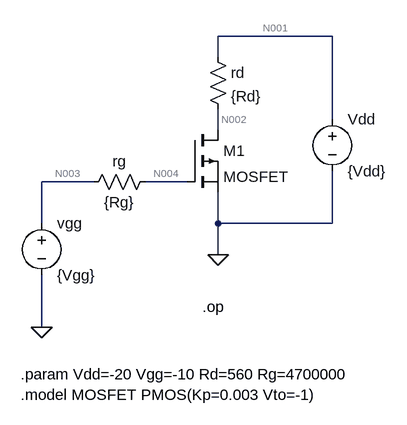
[diagram p0: schematic Q7-4.asc]
Q7-4.asc, the LTspice schematic file:
Version 4
SHEET 1 880 680
WIRE 544 -144 368 -144
WIRE 368 -112 368 -144
WIRE 544 -16 544 -144
WIRE 368 0 368 -32
WIRE 176 80 96 80
WIRE 320 80 256 80
WIRE 96 144 96 80
WIRE 368 144 368 96
WIRE 544 144 544 64
WIRE 544 144 368 144
WIRE 368 192 368 144
WIRE 96 304 96 224
FLAG 368 192 0
FLAG 96 304 0
SYMBOL voltage 96 128 R0
SYMATTR InstName vgg
SYMATTR Value {Vgg}
SYMBOL voltage 544 -32 R0
SYMATTR InstName Vdd
SYMATTR Value {Vdd}
SYMBOL res 352 -128 R0
SYMATTR InstName rd
SYMATTR Value {Rd}
SYMBOL res 272 64 R90
WINDOW 0 0 56 VBottom 2
WINDOW 3 32 56 VTop 2
SYMATTR InstName rg
SYMATTR Value {Rg}
SYMBOL pmos 320 0 R0
SYMATTR InstName M1
SYMATTR Value MOSFET
TEXT 64 376 Left 2 !.param Vdd=-20 Vgg=-10 Rd=560 Rg=4700000\n.model MOSFET PMOS(Kp=0.003 Vto=-1)
TEXT 344 272 Left 2 !.op

The netlist it stands for:
* Q7-4.asc
vgg N003 0 {Vgg}
Vdd N001 0 {Vdd}
rd N001 N002 {Rd}
rg N004 N003 {Rg}
M1 N002 N004 0 0 MOSFET
.model NMOS NMOS
.model PMOS PMOS
.lib standard.mos
.param Vdd=-20 Vgg=-10 Rd=560 Rg=4700000
.model MOSFET PMOS(Kp=0.003 Vto=-1)
.op
.backanno
.end

* Results of the author's LTspice run, read from the files saved beside the schematic
* Operating Point:
*   V(n003) = -10 V
*   V(n001) = -20 V
*   V(n002) = -1.333 V
*   V(n004) = -10 V
*   Id(M1) = -33.33 mA
*   Ig(M1) = 0 A
*   Ib(M1) = 1.343 pA
*   Is(M1) = 33.33 mA
*   I(Rg) = 0 A
*   I(Rd) = -33.33 mA
*   I(Vdd) = 33.33 mA
*   I(Vgg) = 0 A
* From the log:
*   Semiconductor Device Operating Points:
*                           --- MOSFET Transistors ---
*   Name:          m1
*   Model:       mosfet
*   Id:         -3.33e-02
*   Vgs:        -1.00e+01
*   Vds:        -1.33e+00
*   Vbs:         0.00e+00
*   Vth:        -1.00e+00
*   Vdsat:      -9.00e+00
*   Gm:          4.00e-03
*   Gds:         2.30e-02
*   Gmb:         0.00e+00
*   Cbd:         0.00e+00
*   Cbs:         0.00e+00
*   Cgsov:       0.00e+00
*   Cgdov:       0.00e+00
*   Cgbov:       0.00e+00
*   Cgs:         0.00e+00
*   Cgd:         0.00e+00
*   Cgb:         0.00e+00